# EAGLE design KNXTransceiverBoard_V1.2 (EAGLE 6.1)

## Sheet 1 of 3
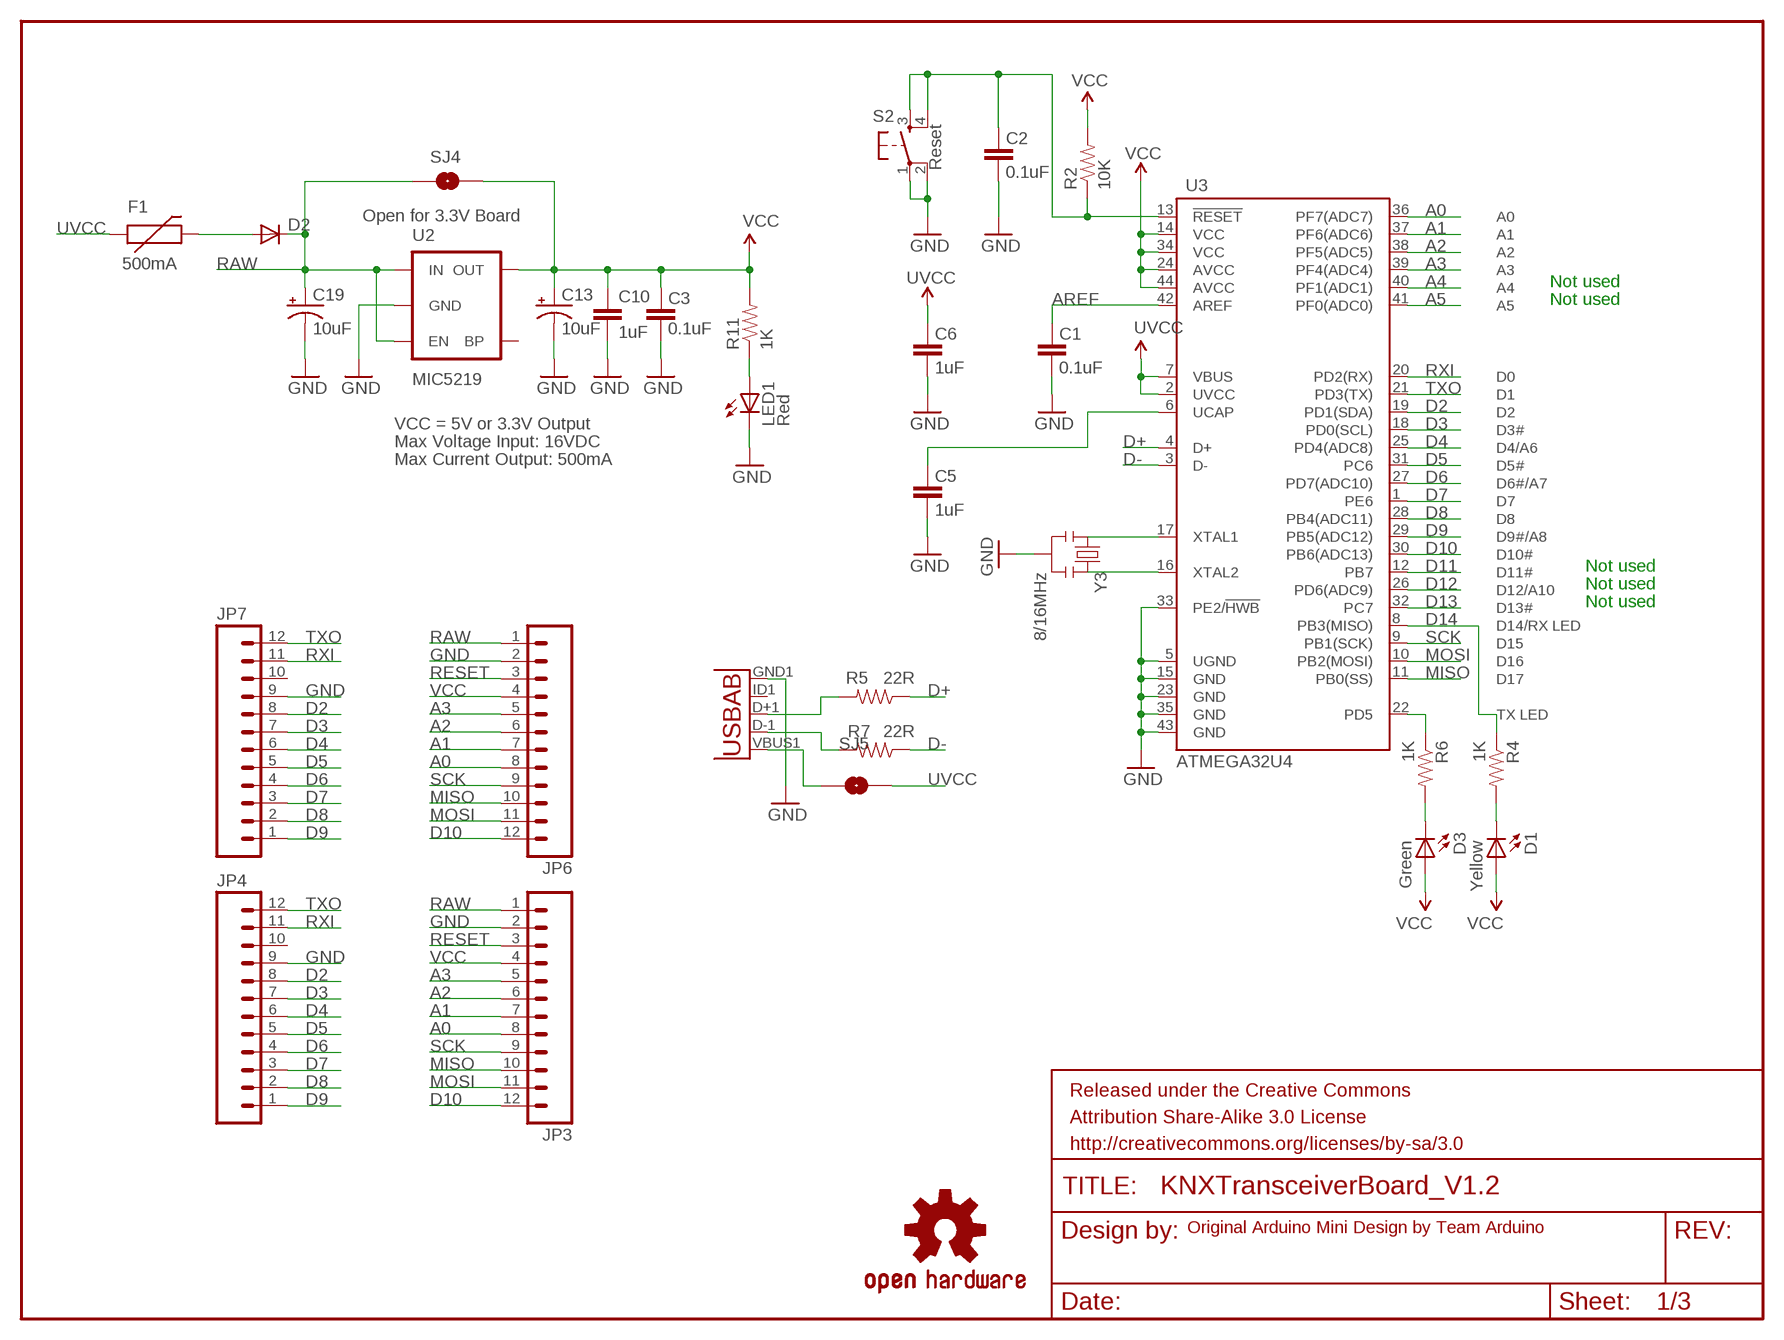
[diagram p0: schematic, sheet 1]

### Parts
C1  0.1uF  CAP0603-CAP  [0603-CAP]
C2  0.1uF  CAP0603-CAP  [0603-CAP]
C3  0.1uF  CAP0603-CAP  [0603-CAP]
C5  1uF  CAP0603-CAP  [0603-CAP]
C6  1uF  CAP0603-CAP  [0603-CAP]
C10  1uF  CAP0603-CAP  [0603-CAP]
C13  10uF  CAP_POL1206  [EIA3216]
C19  10uF  CAP_POL1206  [EIA3216]
D1  Yellow  LED0603  [LED-0603]
D2  DIODESOD  [SOD-323]
D3  Green  LED0603  [LED-0603]
F1  500mA  PTCSMD  [PTC-1206]
FRAME1  FRAME-LETTER  [CREATIVE_COMMONS]
JP3  M12PTH  [1X12]
JP4  M12PTH  [1X12]
JP6  M12PTH  [1X12]
JP7  M12PTH  [1X12]
LED1  Red  LED0603  [LED-0603]
R2  10K  RESISTOR0603-RES  [0603-RES]
R4  1K  RESISTOR0603-RES  [0603-RES]
R5  22R  RESISTOR0603-RES  [0603-RES]
R6  1K  RESISTOR0603-RES  [0603-RES]
R7  22R  RESISTOR0603-RES  [0603-RES]
R11  1K  RESISTOR0603-RES  [0603-RES]
S2  Reset  TAC_SWITCHSMD  [TACTILE_SWITCH_SMD]
SJ4  SOLDERJUMPERNC  [SJ_2S]
SJ5  SOLDERJUMPERNC  [SJ_2S]
U2  MIC5219  V_REG_LDOSMD  [SOT23-5]
U3  ATMEGA32U4  ATMEGA32U4OUTFAKES  [QFN-44-NOPAD_1:1-OUTFAKES]
U$3  OSHW-LOGOS  [OSHW-LOGO-S]
X1  USB-ABIN&OUT  [USB-AB-MICRO-SMD-V03-IN&OUT]
Y3  8/16MHz  RESONATORSMD  [RESONATOR-SMD]

### Nets
A0: JP3.8 JP6.8 U3.36(PF7(ADC7))
A1: JP3.7 JP6.7 U3.37(PF6(ADC6))
A2: JP3.6 JP6.6 U3.38(PF5(ADC5))
A3: JP3.5 JP6.5 U3.39(PF4(ADC4))
A4: U3.40(PF1(ADC1))
A5: U3.41(PF0(ADC0))
AREF: C1.2 U3.42(AREF)
D2: JP4.8 JP7.8 U3.19(PD1(SDA)) ; also sheet 2
D3: JP4.7 JP7.7 U3.18(PD0(SCL)) ; also sheet 2
D4: JP4.6 JP7.6 U3.25(PD4(ADC8))
D5: JP4.5 JP7.5 U3.31(PC6)
D6: JP4.4 JP7.4 U3.27(PD7(ADC10))
D7: JP4.3 JP7.3 U3.1(PE6) ; also sheet 2
D8: JP4.2 JP7.2 U3.28(PB4(ADC11)) ; also sheet 2
D9: JP4.1 JP7.1 U3.29(PB5(ADC12))
D10: JP3.12 JP6.12 U3.30(PB6(ADC13))
D11: U3.12(PB7)
D12: U3.26(PD6(ADC9))
D13: U3.32(PC7)
D14: R4.1 U3.8(PB3(MISO))
D+: R5.1 U3.4(D+)
D-: R7.1 U3.3(D-)
GND [vcc]: C1.1 C2.1 C3.1 C5.1 C6.1 C10.2 C13.C(-) C19.C(-) JP3.2 JP4.9 JP6.2 JP7.9 LED1.C S2.1 S2.2 U2.2(GND) U3.5(UGND) U3.15(GND) U3.23(GND) U3.33(PE2/!HWB) U3.35(GND) U3.43(GND) X1.GND1(GND) Y3.2 ; also sheet 2,3
MISO: JP3.10 JP6.10 U3.11(PB0(SS))
MOSI: JP3.11 JP6.11 U3.10(PB2(MOSI))
N$1: U3.16(XTAL2) Y3.3
N$2: U3.17(XTAL1) Y3.1
N$4: C5.2 U3.6(UCAP)
N$5: D1.C R4.2
N$6: R7.2 X1.D-1(D-)
N$7: D3.C R6.2
N$8: R5.2 X1.D+1(D+)
N$9: D2.2(A) F1.2
N$38: LED1.A R11.1
RAW [vcc]: C19.A(+) D2.1(C) JP3.1 JP6.1 SJ4.1 U2.1(IN) U2.3(EN) ; also sheet 3
RESET: C2.2 JP3.3 JP6.3 R2.1 S2.3 S2.4 U3.13(!RESET)
RXI: JP4.11 JP7.11 U3.20(PD2(RX)) ; also sheet 2
SCK: JP3.9 JP6.9 U3.9(PB1(SCK))
TXLED: R6.1 U3.22(PD5)
TXO: JP4.12 JP7.12 U3.21(PD3(TX)) ; also sheet 2
UVCC: C6.2 F1.1 SJ5.2 U3.2(UVCC) U3.7(VBUS)
VBUS1: SJ5.1 X1.VBUS1(VBUS)
VCC: C3.2 C10.1 C13.A(+) D1.A D3.A JP3.4 JP6.4 R2.2 R11.2 SJ4.2 U2.5(OUT) U3.14(VCC) U3.24(AVCC) U3.34(VCC) U3.44(AVCC) ; also sheet 2,3
Unconnected: JP4.10 JP7.10 U2.4(BP) X1.ID1(USBID)

### Notes on the sheet
- Open for 3.3V Board
- Not used
- Not used
- VCC = 5V or 3.3V Output
- Max Voltage Input: 16VDC
- Max Current Output: 500mA
- Not used
- Not used
- Not used
- Original Arduino Mini Design by Team Arduino

## Sheet 2 of 3
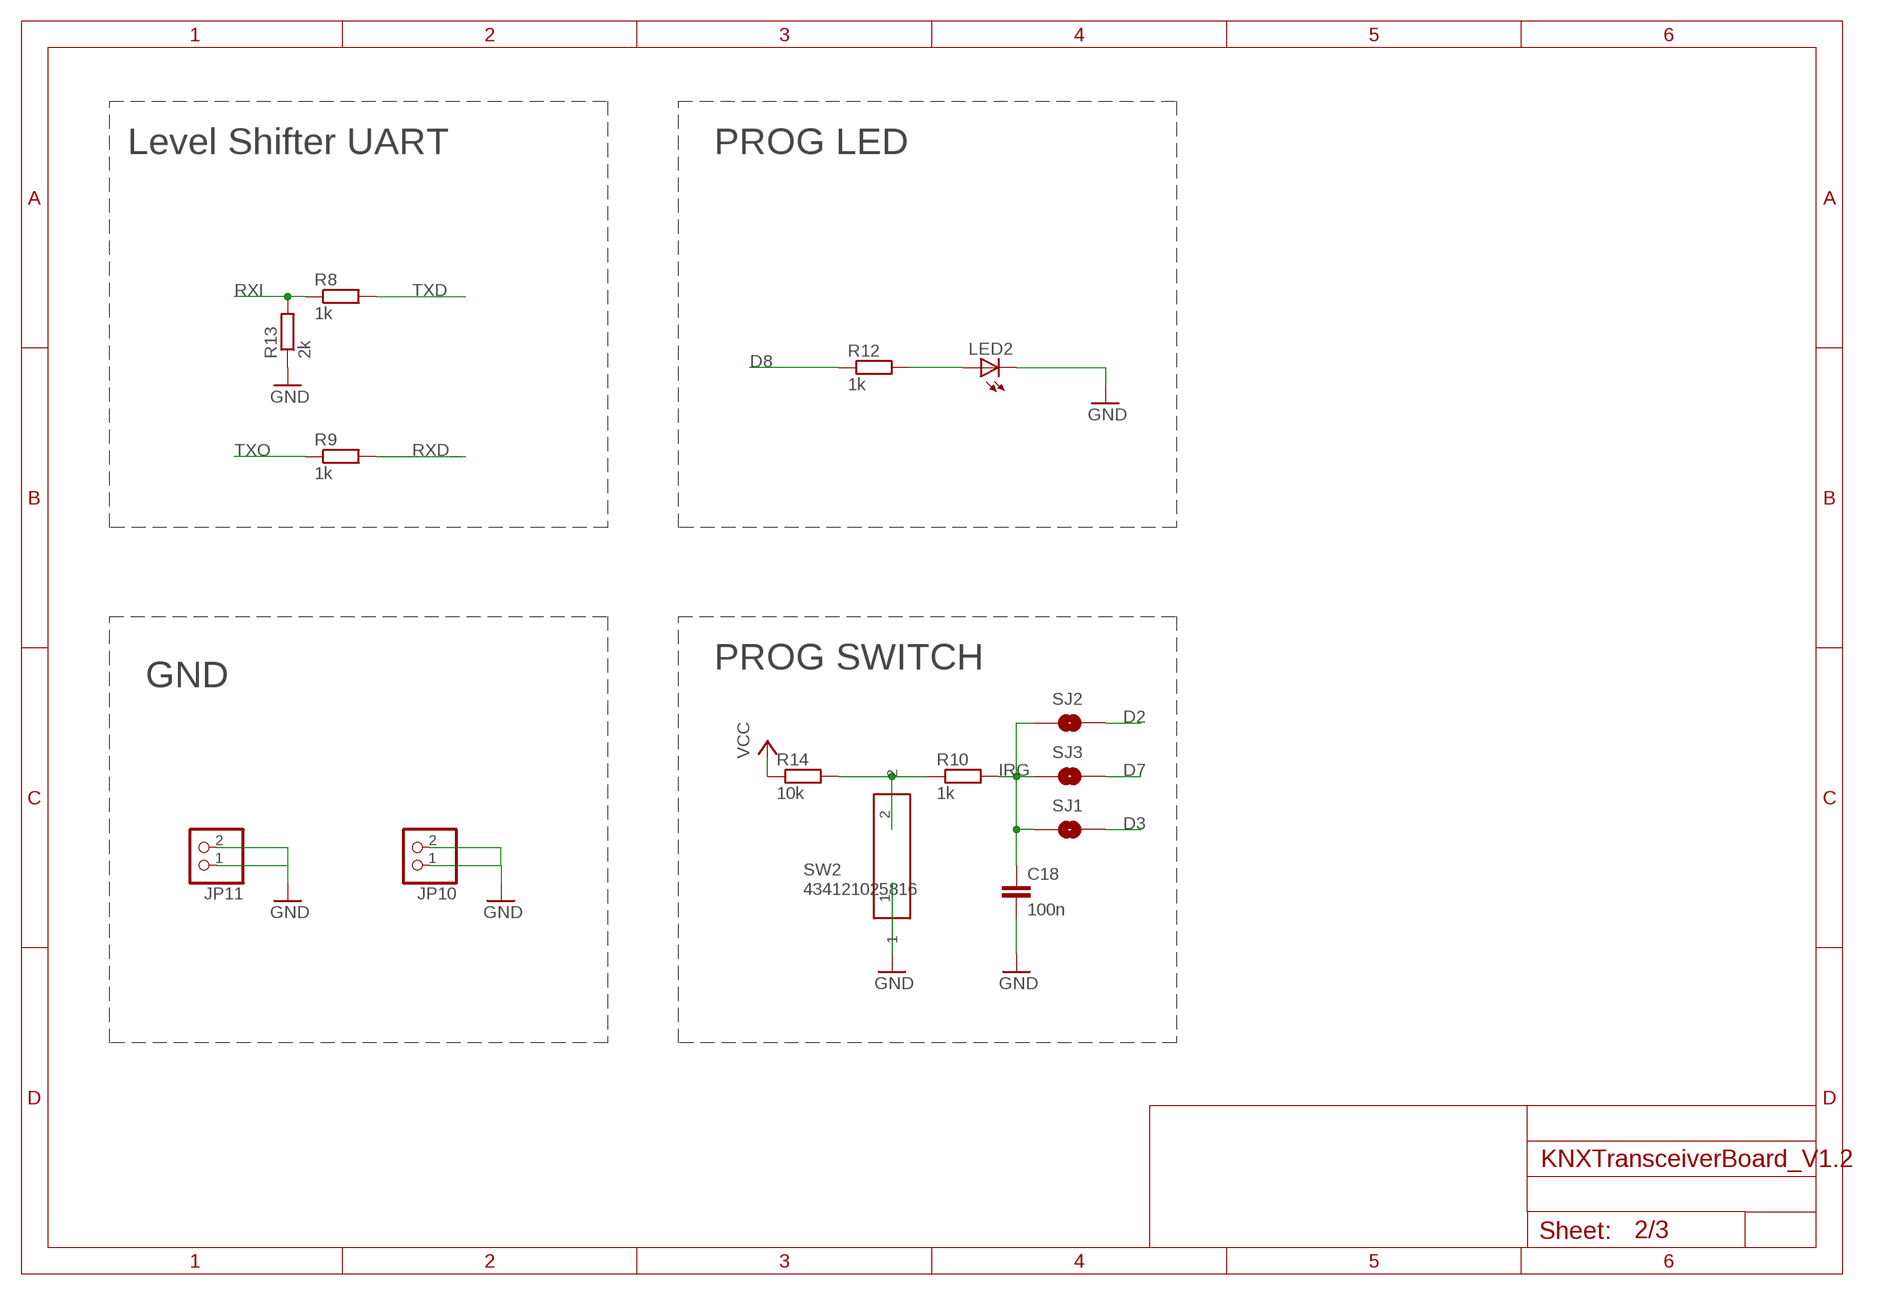
[diagram p1: schematic, sheet 2]

### Parts
C18  100n  C-EUC0603  [C0603]
JP10  PINHD-1X2  [1X02]
JP11  PINHD-1X2  [1X02]
LED2  LEDCHIP-LED0805  [CHIP-LED0805]
R8  1k  R-EU_R0603  [R0603]
R9  1k  R-EU_R0805  [R0805]
R10  1k  R-EU_R0603  [R0603]
R12  1k  R-EU_R0603  [R0603]
R13  2k  R-EU_R0805  [R0805]
R14  10k  R-EU_R0603  [R0603]
SJ1  SOLDERJUMPERNC  [SJ_2S]
SJ2  SOLDERJUMPERNC  [SJ_2S]
SJ3  SOLDERJUMPERNC  [SJ_2S]
SW2  434121025816  [434121025816]

### Nets
D2: SJ2.2 ; also sheet 1
D3: SJ1.2 ; also sheet 1
D7: SJ3.2 ; also sheet 1
D8: R12.1 ; also sheet 1
GND [vcc]: C18.2 JP10.1 JP10.2 JP11.1 JP11.2 LED2.C R13.1 SW2.1 ; also sheet 1,3
IRG: C18.1 R10.2 SJ1.1 SJ2.1 SJ3.1
N$212: LED2.A R12.2
N$237: R10.1 R14.2 SW2.2
RXD: R9.2 ; also sheet 3
RXI: R8.1 R13.2 ; also sheet 1
TXD: R8.2 ; also sheet 3
TXO: R9.1 ; also sheet 1
VCC: R14.1 ; also sheet 1,3

### Notes on the sheet
- Level Shifter UART | PROG LED
- PROG SWITCH
- GND

## Sheet 3 of 3
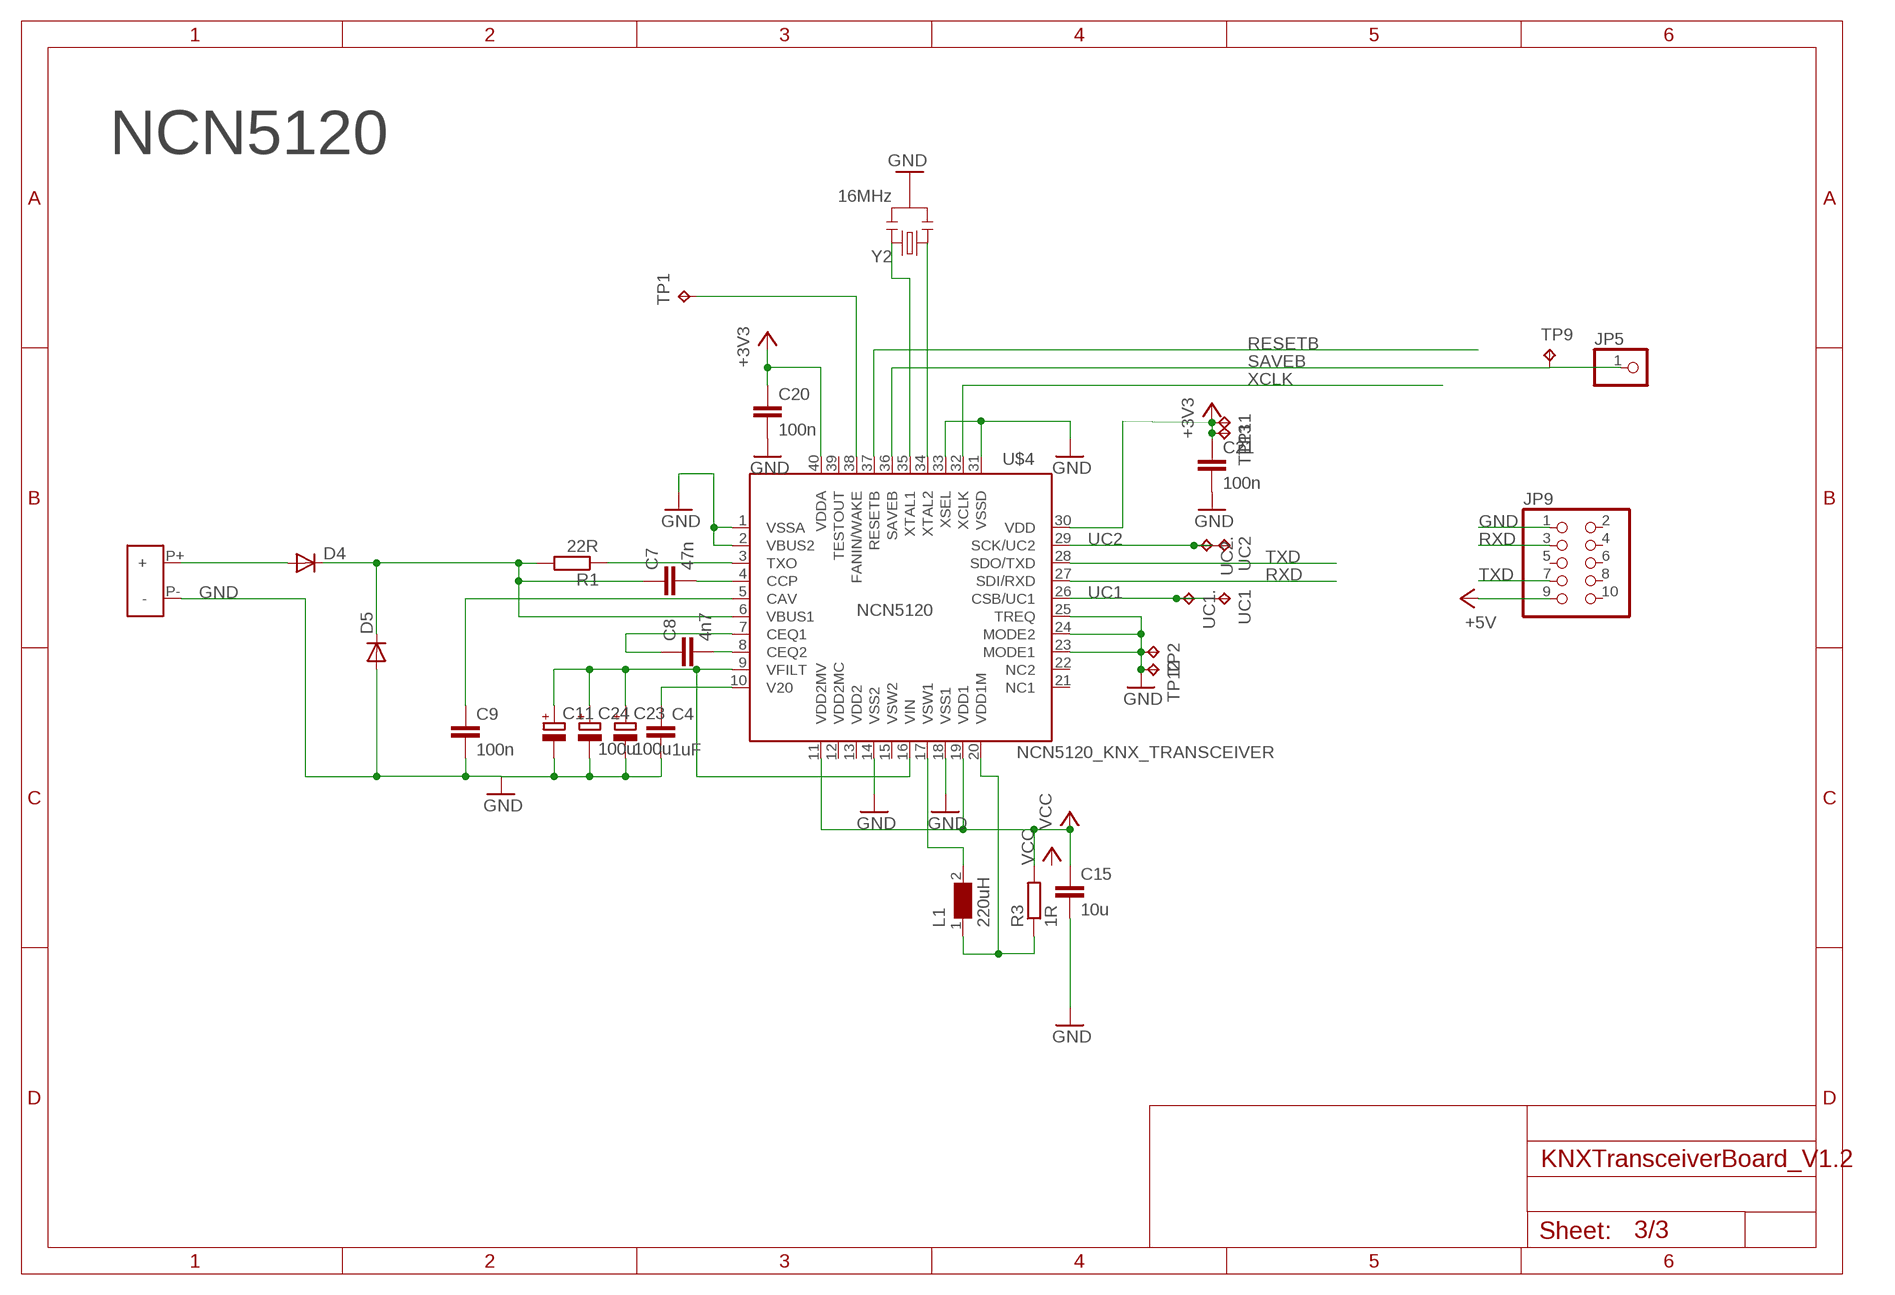
[diagram p2: schematic, sheet 3]

### Parts
C4  1uF  C-EUC0603  [C0603]
C7  47n  C-EUC0603  [C0603]
C8  4n7  C-EUC0603  [C0603]
C9  100n  C-EUC0603  [C0603]
C11  CPOL-EUE  [PANASONIC_E]
C15  10u  C-EUC0805  [C0805]
C20  100n  C-EUC0603  [C0603]
C21  100n  C-EUC0603  [C0603]
C23  100u  CPOL-EUSMCD  [SMC_D]
C24  100u  CPOL-EUSMCD  [SMC_D]
D4  DIODESMA-ALT  [SMA-DIODE_ALT]
D5  DIODESMA-ALT  [SMA-DIODE_ALT]
JP5  PINHD-1X1  [1X01]
JP9  PINHD-2X5  [2X05]
L1  220uH  WE-PD2_7850  [WE-PD2_7850]
R1  22R  R-EU_R2512  [R2512]
R3  1R  R-EU_R0603  [R0603]
TP1  TPTP10SQ  [TP10SQ]
TP2  TPTP09SQ  [TP09SQ]
TP9  TPTP10SQ  [TP10SQ]
TP11  TPTP09SQ  [TP09SQ]
TP12  TPTP09SQ  [TP09SQ]
TP13  TPTP09SQ  [TP09SQ]
U$2  KNX_KLEMME  [KNX_KLEMME]
U$4  NCN5120_KNX_TRANSCEIVER  [QFN40]
UC1  TPTP09SQ  [TP09SQ]
UC1.  TPTP09SQ  [TP09SQ]
UC2  TPTP09SQ  [TP09SQ]
UC2.  TPTP09SQ  [TP09SQ]
Y2  16MHz  RESONATORSMD  [RESONATOR-SMD]

### Nets
GND [vcc]: C4.2 C9.2 C11.- C15.2 C20.2 C21.2 C23.- C24.- D5.A JP9.1 TP2.TP TP12.TP U$2.P-(-) U$4.1(VSSA) U$4.2(VBUS2) U$4.14(VSS2) U$4.18(VSS1) U$4.23(MODE1) U$4.24(MODE2) U$4.25(TREQ) U$4.31(VSSD) U$4.33(XSEL) Y2.2 ; also sheet 1,2
N$10: C7.1 D4.C D5.C R1.2 U$4.6(VBUS1)
N$11: C8.1 U$4.7(CEQ1)
N$12: C11.+ C23.+ C24.+ U$4.9(VFILT) U$4.16(VIN)
N$13: C4.1 U$4.10(V20)
N$15: C7.2 U$4.4(CCP)
N$140: C9.1 U$4.5(CAV)
N$160: C8.2 U$4.8(CEQ2)
N$174: TP1.TP U$4.38(FANIN/WAKE)
N$203: D4.A U$2.P+(+)
N$222: L1.2 U$4.17(VSW1)
N$242: L1.1 R3.1 U$4.20(VDD1M)
N$999: R1.1 U$4.3(TXO)
RAW [vcc]: JP9.9 ; supply symbol labelled +5V ; also sheet 1
RESETB: U$4.37(RESETB)
RXD: JP9.3 U$4.27(SDI/RXD) ; also sheet 2
SAVEB: JP5.1 TP9.TP U$4.36(SAVEB)
TXAL1: U$4.35(XTAL1) Y2.3
TXAL2: U$4.34(XTAL2) Y2.1
TXD: JP9.7 U$4.28(SDO/TXD) ; also sheet 2
UC1: U$4.26(CSB/UC1) UC1..TP UC1.TP
UC2: U$4.29(SCK/UC2) UC2..TP UC2.TP
VCC: C15.1 C20.1 C21.1 R3.2 TP11.TP TP13.TP U$4.11(VDD2MV) U$4.19(VDD1) U$4.30(VDD) U$4.40(VDDA) ; supply symbol labelled +3V3 ; also sheet 1,2
XCLK: U$4.32(XCLK)
Unconnected: JP9.2 JP9.4 JP9.5 JP9.6 JP9.8 JP9.10 U$4.12(VDD2MC) U$4.13(VDD2) U$4.15(VSW2) U$4.21(NC1) U$4.22(NC2) U$4.39(TESTOUT)

### Notes on the sheet
- NCN5120

## Library data of the parts
C1-C3 C5 C6 C10 = SparkFun:CAP: Capacitor Standard 0603 ceramic capacitor, and 0.1" leaded capacitor.
C4 C7-C9 C15 C18 C20 C21 = rcl:C-EU: CAPACITOR, European symbol
C11 C23 C24 = rcl:CPOL-EU: POLARIZED CAPACITOR, European symbol
C13 C19 = SparkFun:CAP_POL: Capacitor Polarized These are standard SMD and PTH capacitors. Normally 10uF, 47uF, and 100uF in electrolytic and tantalum varieties. Always verify the external diameter of the through hole cap, it varies with capacity, voltage, and manufacturer. The EIA devices should be standard.
D1 D3 LED1 = SparkFun:LED: LEDs Standard schematic elements and footprints for 5mm, 3mm, 1206, and 0603 sized LEDs. 5mm - Spark Fun Electronics SKU : COM-00529 (and others)
D2 D4 D5 = SparkFun:DIODE: Diode These are standard reverse protection diodes and small signal diodes. SMA package can handle up to about 1A. SOD-323 can handle about 200mA. What the SOD-323 package when ordering, there are some mfgs out there that are 5-pin packages.
F1 = SparkFun:PTC: Resettable Fuse PTC Resettable Fuse. Spark Fun Electronics SKU : COM-08357
FRAME1 = SparkFun-Aesthetics:FRAME-LETTER: Schematic Frame Standard 8.5x11 US Letter frame
JP3 JP4 JP6 JP7 = SparkFun:M12: Header 12 Standard 12-pin 0.1" header. Use with straight break away headers (SKU : PRT-00116), right angle break away headers (PRT-00553), swiss pins (PRT-00743), machine pins (PRT-00117), and female headers (PRT-00115).
JP5 = pinhead:PINHD-1X1: PIN HEADER
JP9 = pinhead:PINHD-2X5: PIN HEADER
JP10 JP11 = pinhead:PINHD-1X2: PIN HEADER
L1 = Wuerth_PowerMagnetics:WE-PD2: SMD-Power Inductors WE-PD2 - Industry standard size - Current capability up to 14 A -- Switching regulators with low operating voltages (computer, laptop, mobile phones, pagers) -- Integrated DC/DC-converter -- Is recommended for the application with switching regulators from National Semiconductor, Linear Technology, Texas Instruments and Fairchild Semiconductor -- Perfectly suitable for switching regulators with extremely high efficiency
LED2 = led:LED: LED OSRAM: - CHIPLED LG R971, LG N971, LY N971, LG Q971, LY Q971, LO R971, LY R971 LH N974, LH R974 LS Q976, LO Q976, LY Q976 LO Q996 - Hyper CHIPLED LW Q18S LB Q993, LB Q99A, LB R99A - SideLED LS A670, LO A670, LY A670, LG A670, LP A670 LB A673, LV A673, LT A673, LW A673 LH A674 LY A675 LS A676, LA A676, LO A676, LY A676, LW A676 LS A679, LY A679, LG A679 - Hyper Micro SIDELED® LS Y876, LA Y876, LO Y876, LY Y876 LT Y87S - SmartLED LW L88C, LW L88S LB L89C, LB L89S, LG L890 LS L89K, LO L89K, LY L89K LS L896, LA L896, LO L896, LY L896 - TOPLED LS T670, LO T670, LY T670, LG T670, LP T670 LSG T670, LSP T670, LSY T670, LOP T670, LYG T670 LG T671, LOG T671, LSG T671 LB T673, LV T673, LT T673, LW T673 LH T674 LS T676, LA T676, LO T676, LY T676, LB T676, LH T676, LSB T676, LW T676 LB T67C, LV T67C, LT T67C, LS T67K, LO T67K, LY T67K, LW E67C LS E67B, LA E67B, LO E67B, LY E67B, LB E67C, LV E67C, LT E67C LW T67C LS T679, LY T679, LG T679 LS T770, LO T770, LY T770, LG T770, LP T770 LB T773, LV T773, LT T773, LW T773 LH T774 LS E675, LA E675, LY E675, LS T675 LS T776, LA T776, LO T776, LY T776, LB T776 LHGB T686 LT T68C, LB T68C - Hyper Mini TOPLED® LB M676 - Mini TOPLED Santana® LG M470 LS M47K, LO M47K, LY M47K Source: http://www.osram.convergy.de LUXEON: - LUMILED® LXK2-PW12-R00, LXK2-PW12-S00, LXK2-PW14-U00, LXK2-PW14-V00 LXK2-PM12-R00, LXK2-PM12-S00, LXK2-PM14-U00 LXK2-PE12-Q00, LXK2-PE12-R00, LXK2-PE12-S00, LXK2-PE14-T00, LXK2-PE14-U00 LXK2-PB12-K00, LXK2-PB12-L00, LXK2-PB12-M00, LXK2-PB14-N00, LXK2-PB14-P00, LXK2-PB14-Q00 LXK2-PR12-L00, LXK2-PR12-M00, LXK2-PR14-Q00, LXK2-PR14-R00 LXK2-PD12-Q00, LXK2-PD12-R00, LXK2-PD12-S00 LXK2-PH12-R00, LXK2-PH12-S00 LXK2-PL12-P00, LXK2-PL12-Q00, LXK2-PL12-R00 Source: www.luxeon.com KINGBRIGHT: KA-3528ASYC Source: www.kingbright.com
R1 R3 R8-R10 R12-R14 = rcl:R-EU_: RESISTOR, European symbol
R2 R4-R7 R11 = SparkFun:RESISTOR: Resistor Basic schematic elements and footprints for 0603, 1206, and PTH resistors.
S2 = SparkFun:TAC_SWITCH: Momentary Switch Button commonly used for reset or general input. Spark Fun Electronics SKU : COM-00097
SJ1-SJ5 = SparkFun:SOLDERJUMPER: Solder Jumper Standard SMD solder jumper. Used to automate production. Two varients : Normally Open and Normally Closed are the same, but have different paste layers. NC will have a large amount of paste and should jumper during reflow.
SW2 = Wuerth_Kurzhubtaster:434121025816: WS-TRS-6x3.8 mm SMD Tact Switch, 2 pins
TP1 TP2 TP9 TP11-TP13 UC1 UC1. UC2 UC2. = testpad:TP: Test pad
U2 = SparkFun:V_REG_LDO: Voltage Regulator LDO Standard 150mA LDO voltage regulator in SOT-23 layout. Micrel part MIC5205. BP (by-pass) pin is used to lower output noise with 470pF cap.
U3 = Testing:ATMEGA32U4: Atmel 44-pin 8-bit Microcontroller with 32KBytes of ISP Flash and USB Controller
U$2 = Matthias_1:KNX_KLEMME
U$3 = SparkFun:OSHW-LOGO: Open Source Hardware Logo This logo indicates the piece of hardware it is found on incorporates a OSHW license and/or adheres to the definition of open source hardware found here: http://freedomdefined.org/OSHW
U$4 = Matthias_1:NCN5120_KNX_TRANSCEIVER
X1 = Testing:USB-AB: This is a USB AB connector that is compatible with USB OTG. i.e. this connector can serve as a host or device
Y2 Y3 = SparkFun:RESONATOR: Resonator Small SMD resonator. This is the itty bitty 10/20MHz resonators with built in caps. CSTCE10M0G55 and CSTCE20M0V53. Footprint has been reviewed closely but hasn't been tested yet.

## Net classes
0 default: width 0.203 mm
1 vcc: width 0.254 mm

## Board
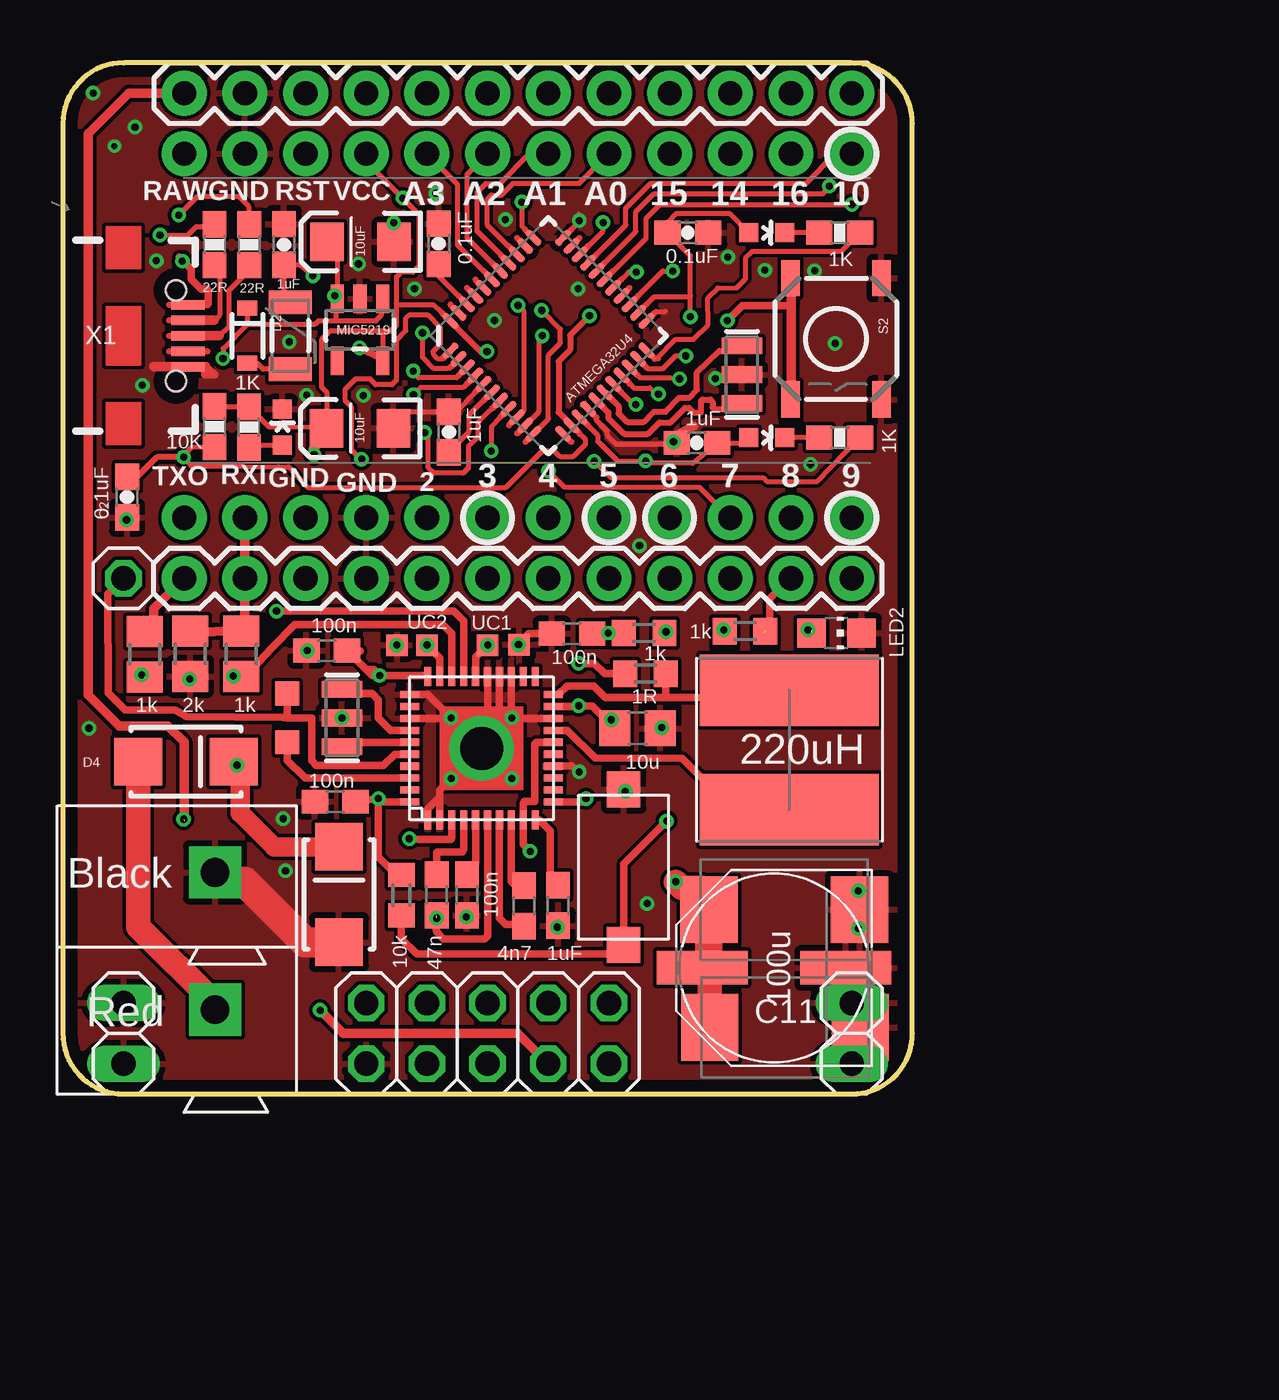
[diagram p3: board, top side]
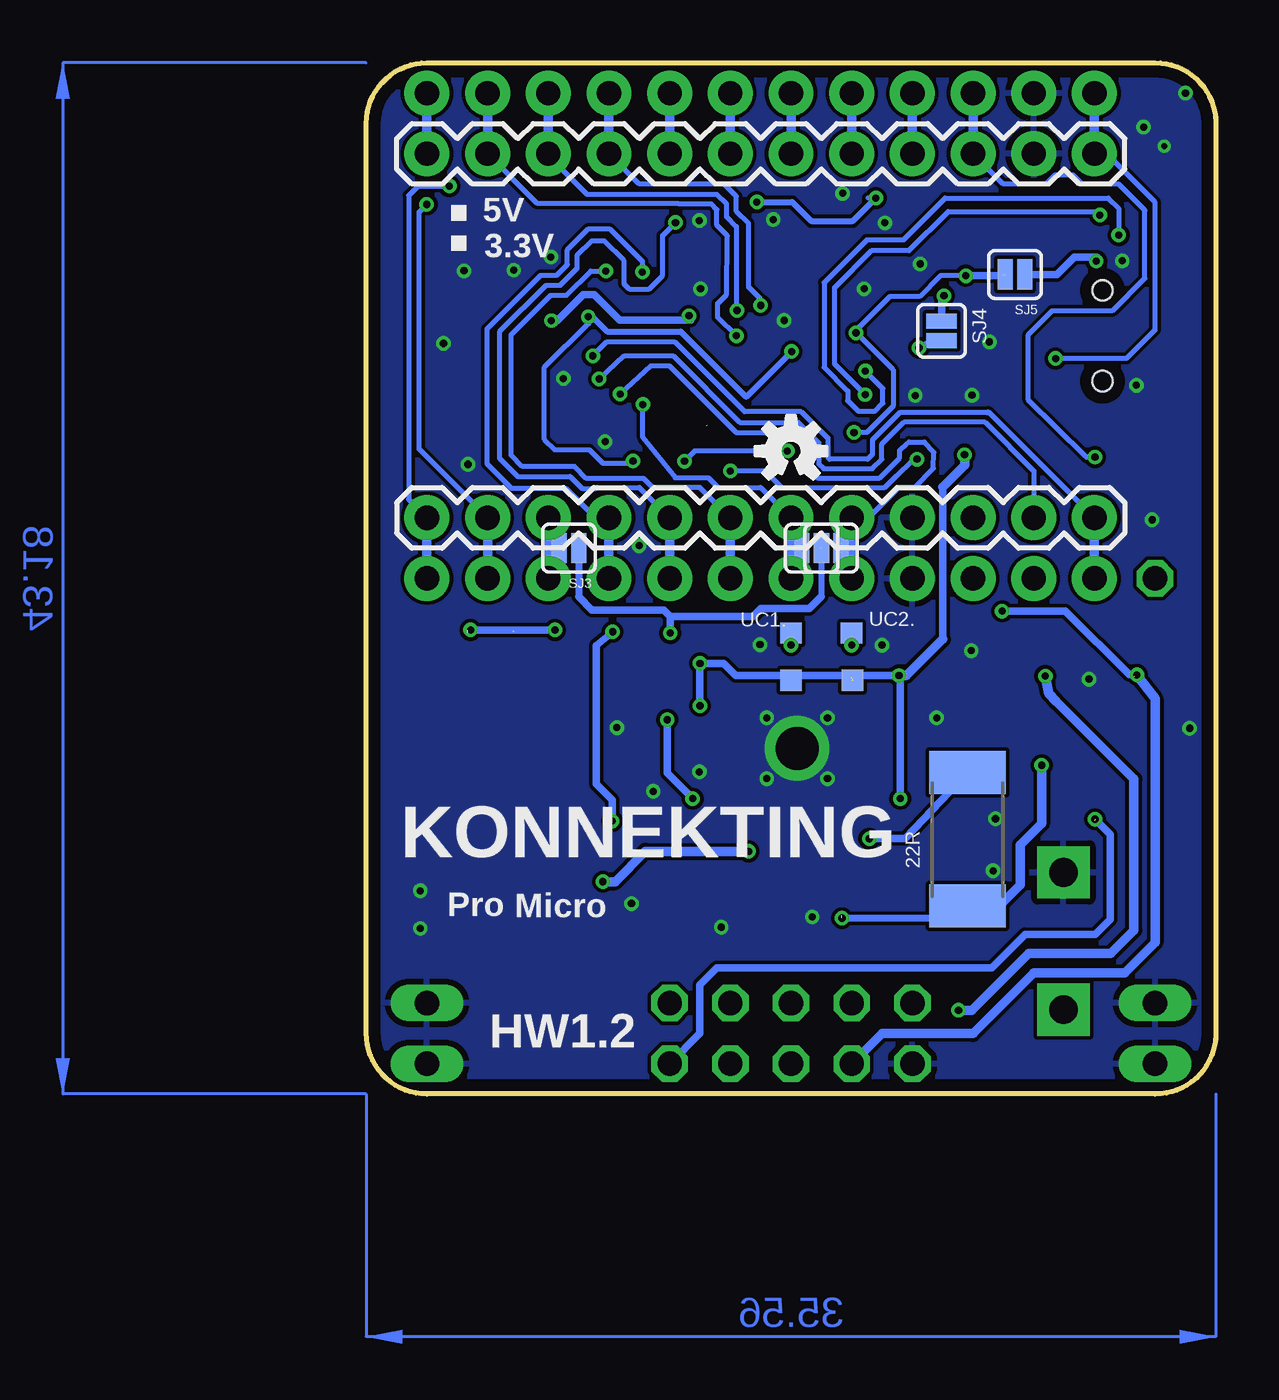
[diagram p4: board, bottom side, seen from below]

Size 35.56 x 43.18 mm. Coordinates in mm from the lower left corner, seen from the top.
Outline: 0,2.54 arc90 2.54,0 33.02,0 arc90 35.56,2.54 35.56,40.64 arc90 33.02,43.18 2.54,43.18 arc90 0,40.64 0,2.54
Copper layers (1*16): Top 0.035mm / dielectric 1.6mm / Bottom 0.035mm
Design rules: minimum track width 6mil, minimum drill 12mil, track to track 6mil, track to pad 6mil, pad to pad 6mil, via to via 8mil, smd to smd 0mil, copper to edge 20mil, drill to drill 10mil, minimum pad ring 6mil, minimum via ring 6mil, stop-mask expansion 0mil, vias tented up to drill 100mil, thermal gap 10mil
tRestrict: area -21.3,-1.8 to -21.1,-1.7; area -17.4,2.2 to -17.3,2.2; area -25,-1.2 to -17.9,6.1

### Footprints (pad centres in the part's own frame; a part is rotated, then mirrored left to right if it is on the bottom)
0603-CAP = smd 1.1 x 1: 1 -0.85,0; 2 0.85,0
C0603 = smd 1.1 x 1: 1 -0.85,0; 2 0.85,0
PANASONIC_E = smd 3.8 x 1.4: + 3,0; - -3,0
EIA3216 = smd 1.4 x 1.6: A 1.4,0; C -1.4,0
C0805 = smd 1.3 x 1.5: 1 -0.95,0; 2 0.95,0
SMC_D = smd 2.4 x 2.8: + -3.15,0; - 3.15,0
LED-0603 = smd 0.8 x 0.8: A 0,-0.75; C 0,0.75
SOD-323 = smd 0.63 x 0.83: 1 -1.15,0; 2 1.15,0
SMA-DIODE_ALT = smd 2 x 2: A -2,0; C 2,0
PTC-1206 = smd 1 x 1.8: 1 -1.4,0; 2 1.4,0
1X12 = drill 1.016 pad 1.88: 1 0,0; 2 2.54,0; 3 5.08,0; 4 7.62,0; 5 10.16,0; 6 12.7,0; 7 15.24,0; 8 17.78,0; 9 20.32,0; 10 22.86,0; 11 25.4,0; 12 27.94,0
1X01 = drill 1.016 octagon: 1 0,0
2X05 = drill 1.016 octagon: 1 -5.08,-1.27; 2 -5.08,1.27; 3 -2.54,-1.27; 4 -2.54,1.27; 5 0,-1.27; 6 0,1.27; 7 2.54,-1.27; 8 2.54,1.27; 9 5.08,-1.27; 10 5.08,1.27
1X02 = drill 1.016 long: 1 -1.27,0; 2 1.27,0
WE-PD2_7850 = smd 3 x 7.5: 1 -2.5,0; 2 2.5,0
CHIP-LED0805 = smd 1.2 x 1.2: A 0,-1.05; C 0,1.05
R2512 = smd 1.8 x 3.2: 1 -2.8,0; 2 2.8,0
0603-RES = smd 1.1 x 1: 1 -0.85,0; 2 0.85,0
R0603 = smd 1 x 1.1: 1 -0.85,0; 2 0.85,0
R0805 = smd 1.3 x 1.5: 1 -0.95,0; 2 0.95,0
TACTILE_SWITCH_SMD = smd 1.524 x 0.762: 1 -2.54,1.905; 2 2.54,1.905; 3 -2.54,-1.905; 4 2.54,-1.905
SJ_2S = smd 0.635 x 1.27: 1 -0.412,0; 2 0.412,0
434121025816 = smd 1.5 x 1.4: 1 -3.25,0; 2 3.25,0
TP10SQ = smd 1 x 1: TP 0,0
TP09SQ = smd 0.9 x 0.9: TP 0,0
SOT23-5 = smd 0.55 x 1.2: 1 -0.95,-1.3; 2 0,-1.3; 3 0.95,-1.3; 4 0.95,1.3; 5 -0.95,1.3
QFN-44-NOPAD_1:1-OUTFAKES = smd 0.8 x 0.3: 1 -3.337,2.465; 2 -3.337,1.972; 3 -3.337,1.479; 4 -3.337,0.986; 5 -3.337,0.493; 6 -3.337,0; 7 -3.337,-0.493; 8 -3.337,-0.986; 9 -3.337,-1.479; 10 -3.337,-1.972; 11 -3.337,-2.465; 23 3.337,-2.465; 24 3.337,-1.972; 25 3.337,-1.479; 26 3.337,-0.986; 27 3.337,-0.493; 28 3.337,0; 29 3.337,0.493; 30 3.337,0.986; 31 3.337,1.479; 32 3.337,1.972; 33 3.337,2.465 | smd 0.3 x 0.8: 12 -2.465,-3.337; 13 -1.972,-3.337; 14 -1.479,-3.337; 15 -0.986,-3.337; 16 -0.493,-3.337; 17 0,-3.337; 18 0.493,-3.337; 19 0.986,-3.337; 20 1.479,-3.337; 21 1.972,-3.337; 22 2.465,-3.337; 34 2.465,3.337; 35 1.972,3.337; 36 1.479,3.337; 37 0.986,3.337; 38 0.493,3.337; 39 0,3.337; 40 -0.493,3.337; 41 -0.986,3.337; 42 -1.479,3.337; 43 -1.972,3.337; 44 -2.465,3.337
KNX_KLEMME = drill 1.2 pad 2.184 square: P+ 0,-3.2; P- 0,2.55
QFN40 = smd 0.3 x 0.8: 1 -2.25,-3; 2 -1.75,-3; 3 -1.25,-3; 4 -0.75,-3; 5 -0.25,-3; 6 0.25,-3; 7 0.75,-3; 8 1.25,-3; 9 1.75,-3; 10 2.25,-3; 21 2.25,3; 22 1.75,3; 23 1.25,3; 24 0.75,3; 25 0.25,3; 26 -0.25,3; 27 -0.75,3; 28 -1.25,3; 29 -1.75,3; 30 -2.25,3 | smd 0.8 x 0.3: 11 3,-2.25; 12 3,-1.75; 13 3,-1.25; 14 3,-0.75; 15 3,-0.25; 16 3,0.25; 17 3,0.75; 18 3,1.25; 19 3,1.75; 20 3,2.25; 31 -3,2.25; 32 -3,1.75; 33 -3,1.25; 34 -3,0.75; 35 -3,0.25; 36 -3,-0.25; 37 -3,-0.75; 38 -3,-1.25; 39 -3,-1.75; 40 -3,-2.25
USB-AB-MICRO-SMD-V03-IN&OUT = smd 1.4 x 0.4: D+1 2.7,0; D-1 2.7,0.65; GND1 2.7,-1.3; ID1 2.7,-0.65; VBUS1 2.7,1.3 | hole 0.85: 2.2,1.9; 2.2,-1.9
RESONATOR-SMD = smd 0.7 x 1.7: 1 -1.2,0; 2 0,0; 3 1.2,0

### Placement (x,y rotation side)
C1  15.73,35.6 270 top
C2  2.69,24.99 90 top
C3  26.16,36.07 180 top
C4  20.73,7.9 270 top
C5  16.15,27.71 270 top
C6  9.26,35.57 270 top
C7  15.65,8.33 90 top
C8  19.3,7.87 90 top
C9  16.92,8.33 270 top
C10  26.54,27.27 180 top
C11  29.77,5.28 180 top
C13  12.44,27.88 180 top
C15  24.05,15.32 0 top
C18  21.31,19.28 180 top
C19  12.46,35.68 180 top
C20  11.4,12.24 180 top
C21  11.05,18.57 180 top
C23  30.2,7.72 0 top
C24  30.23,2.79 0 top
D1  29.46,27.48 270 top
D2  7.72,31.75 270 top
D3  29.46,36.07 270 top
D4  5.16,13.92 0 top
D5  11.56,8.36 90 top
F1  9.53,31.75 270 top
FRAME1  -47.73,-21.59 0 top  (outside the outline)
JP3  5.08,41.91 0 top
JP4  33.02,21.59 180 top
JP5  2.54,21.59 0 top
JP6  5.08,39.37 180 bottom
JP7  33.02,24.13 0 bottom
JP9  17.78,2.54 0 top
JP10  33.02,2.54 90 top
JP11  2.54,2.54 90 top
L1  30.4,14.4 270 top
LED1  9.18,27.93 0 top
LED2  32.39,19.3 270 top
R1  10.39,10.67 270 bottom
R2  6.35,27.94 90 top
R3  24.38,17.6 180 top
R4  32.51,27.48 180 top
R5  7.8,35.56 270 top
R6  32.51,36.07 180 top
R7  6.35,35.56 270 top
R8  1k  [R0805]  7.47,18.44 270 top
R9  3.43,18.41 270 top
R10  24.33,19.3 180 top
R11  7.79,27.93 90 top
R12  28.55,19.38 180 top
R13  5.33,18.44 90 top
R14  14.17,8.33 270 top
S2  32.36,31.62 270 top
SJ1  16.92,22.86 180 bottom
SJ2  16.1,22.86 0 bottom
SJ3  27.08,22.86 180 bottom
SJ4  11.48,31.95 270 bottom
SJ5  8.41,34.32 180 bottom
SW2  23.47,9.5 270 top
TP1  9.4,14.73 0 top
TP2  14,18.8 0 top
TP9  9.4,16.76 0 top
TP11  15.21,17.32 0 bottom
TP12  19.1,18.82 0 top
TP13  17.78,17.32 0 bottom
U2  12.44,32 180 top
U3  20.32,31.75 45 top
U$2  6.38,6.73 0 top
U$3  17.78,26.92 0 bottom
U$4  17.53,14.48 0 top
UC1  17.78,18.8 0 top
UC1.  17.78,19.3 0 bottom
UC2  15.24,18.8 0 top
UC2.  15.24,19.3 0 bottom
X1  2.54,31.75 0 top
Y2  11.68,15.75 270 top
Y3  28.42,30.12 270 top

### Tracks (layer width: path | path; a pad name or v marks a point on that pad's centre or on a via)
A0
  Top 0.203: U3.36 17.77,36.39 17.77,37.47 17.94,37.64 18.35,37.64 18.84,38.13 21.62,38.13 JP6.8
  Bottom 0.406: JP3.8 JP6.8
A1
  Top 0.203: U3.37 17.34,36.12 17.34,37.77 17.7,38.13 18.28,38.13 19.53,39.37 JP6.7
  Bottom 0.406: JP3.7 JP6.7
A2
  Top 0.203: U3.38 16.93,35.84 16.93,38.52 JP6.6
  Bottom 0.406: JP3.6 JP6.6
A3
  Top 0.203: 16.52,35.54 16.52,35.55 | 17.61,34.46 16.52,35.55 | 16.52,35.55 16.52,38.08 JP6.5
  Bottom 0.406: JP3.5 JP6.5
AREF
  Top 0.203: 16.57,33.41 15.73,34.25 C1.2
D2  (via drill 0.3)
  Top 0.203: 23.72,29.74 23.9,29.57 24.57,29.57 v24.93,29.31
  Bottom 0.203: v24.93,29.31 23.66,30.48 22.86,30.48 20.07,27.69 17.6,27.69 17,27.09 17,26.14 16.66,25.79 14.07,25.79 13.23,26.63 13.23,26.96 12.94,27.23 12.83,27.3 12.2,27.3 11.8,26.88 11.82,26.2 12.58,25.41 13.24,25.41 14.53,24.13 JP7.8
  Bottom 0.406: JP4.8 15.24,22.86 | 15.24,22.86 JP7.8 | SJ2.2 15.24,22.86
D3  (via drill 0.3)
  Top 0.203: 23.38,29.39 23.88,28.88 v23.99,28.88
  Bottom 0.203: JP7.7 19.05,25.4 20.83,25.4 21.23,25.81 22.63,25.81 23.99,27.49 v23.99,28.88
  Bottom 0.406: JP4.7 17.78,22.86 | 17.78,22.86 JP7.7 | SJ1.2 17.78,22.86
D4  (via drill 0.3)
  Top 0.203: 24.07,33.41 25.12,34.46 v25.53,34.46
  Bottom 0.203: JP7.6 21.59,25.4 23.57,25.4 23.95,25.78 26.34,25.78 26.84,26.28 29.03,26.28 29.5,26.75 29.5,31.79 27.84,33.44 27.19,33.44 26.17,34.46 v25.53,34.46
  Bottom 0.406: JP4.6 JP7.6
D5  (via drill 0.3)
  Top 0.203: 21.98,35.5 22.61,36.13 v22.61,36.49
  Bottom 0.203: JP7.5 24.13,25.4 25.91,25.4 25.95,25.36 26.53,25.36 27.02,25.85 29.22,25.85 29.99,26.62 29.99,31.91 28.04,33.86 27.43,33.86 27.43,33.87 26.74,34.57 26.74,35.11 26.13,35.72 25.6,35.72 24.77,34.9 24.77,33.91 24.56,33.71 23.72,33.71 23.16,34.27 23.16,35.95 v22.61,36.49
  Bottom 0.406: JP4.5 JP7.5
D6  (via drill 0.3)
  Top 0.203: v24,34.42 23.69,34.42 v24,34.42 | U3.27 23.68,34.42 v24,34.42
  Bottom 0.203: v24,34.42 24,34.87 25.37,36.23 26.26,36.23 27.14,35.35 27.14,34.73 27.6,34.27 28.27,34.27 30.51,32.03 30.51,26.39 29.49,25.37 27.22,25.37 25.98,24.13 JP7.4
  Bottom 0.406: JP4.4 JP7.4
D7  (via drill 0.3)
  Top 0.203: JP7.3 26.67,25.4 21.01,25.4 v20.32,26.09 | v12.51,26.58 12.36,26.68 12.14,26.89 12.29,26.75 12.07,26.98 12.07,28.78 11.83,29.03 11.83,29.52 12.26,29.95 12.85,29.95 13.09,29.7 13.78,29.7 13.96,29.89 13.96,31.58 13.98,31.58 14.36,31.96 14.36,32.5 14.51,32.63 15.27,32.63 15.8,32.1 15.8,31.41 15.5,31.1 15.53,30.95 15.7,30.78 15.91,30.78 U3.1 15.9,30.79
  Bottom 0.203: v12.51,26.58 12.68,26.55 12.67,26.57 13.4,25.86 13.86,25.4 18.16,25.4 18.85,26.09 v20.32,26.09
  Bottom 0.406: JP4.3 27.94,22.86 | 27.94,22.86 JP7.3 | SJ3.2 27.94,22.86
D8  (via drill 0.3)  (1 unrouted)
  Top 0.203: U3.28 24.41,35.84 24.41,36.66 24.98,37.24 31.62,37.24 31.64,37.25 v33.03,37.25
  Top 0.305: JP4.2 30.43,21.59 29.59,20.75 29.59,19.58 29.36,19.36
  Bottom 0.203: JP7.2 33.35,27 33.35,36.93 v33.03,37.25
  Bottom 0.406: JP4.2 JP7.2
D9  (via drill 0.3)
  Top 0.203: 22.68,34.81 23.99,36.12 23.99,36.94 24.74,37.69 31.8,37.69 32.08,37.98 v32.08,38.02
  Bottom 0.203: JP7.1 33.78,24.89 33.78,37.62 33.38,38.02 v32.08,38.02
  Bottom 0.406: JP4.1 JP7.1
D10
  Top 0.203: JP6.12 32.33,39.37 31.09,38.12 24.59,38.12 23.56,37.1 23.56,36.39 U3.30
  Bottom 0.406: JP3.12 JP6.12
D14  (via drill 0.3)
  Top 0.203: R4.1 31.58,25.65 29.46,25.65 29.31,25.81 22.95,25.81 v22.24,26.5 | 18.32,28.36 17.93,27.94 v17.93,26.92
  Bottom 0.203: v17.93,26.92 21.81,26.92 v22.24,26.5
D+  (via drill 0.3)
  Top 0.203: v4.85,36.8 5.64,37.59 7.37,37.59 7.8,37.16 R5.1 | U3.4 16.76,29.58 14.97,29.58 v14.68,29.29
  Bottom 0.203: v4.85,36.8 5,36.96 11.2,36.96 12.85,35.31 14.42,35.31 15.95,33.77 15.97,33.77 15.97,30.58 v14.68,29.29
D-  (via drill 0.3)
  Top 0.203: 6.03,36.41 R7.1 6.26,36.32 5.59,36.32 5.23,35.97 v4.06,35.97 | v14.67,30.27 14.89,30 16.48,30 16.58,30.1
  Bottom 0.203: v4.06,35.97 4.06,37.08 4.5,37.52 11.33,37.52 13.08,35.76 14.62,35.76 16.39,33.98 16.39,30.43 15.4,29.44 15.4,29.04 15.41,29.04 14.95,28.58 14.29,28.58 13.93,28.93 13.93,29.54 v14.67,30.27
GND  (via drill 0.25, 0.3, 1.8)
  Top 0.203: 21.67,36.57 v21.61,36.58 | U3.33 21.59,36.51 21.59,36.83 | C3.1 26.82,36.07 | 22.33,28.34 22.33,28.22 22.79,27.76 22.79,27.57 23.15,27.21 25.1,27.21 25.49,27.34 C10.2 25.64,27.54 | 24.77,32.72 24.82,32.77 25.22,32.77 | 13.84,28.24 C13.C 14.47,28.56 C5.1 16.44,28.56 17.28,29.4
  Top 0.305: U$4.23 18.78,15.77 v18.8,15.75 | U$4.25 17.78,15.75 18.29,15.75 | 18.29,15.75 v18.8,15.75 | U$4.24 18.28,15.76 18.29,15.75 | U$4.33 16.24,15.73 v16.26,15.75 15.28,16.73 U$4.31 | U$4.2 15.78,12.45 | 15.78,12.45 15.78,12.73 v16.26,13.21 | U$4.1 15.28,11.95 15.78,12.45 | U$4.18 18.79,15.73 | 18.79,15.73 18.75,15.77 | 18.79,15.73 v18.79,15.74 v18.8,15.75 | U$4.14 21.3,13.73 v21.61,13.49 | C18.2 19.51,19.28 19.03,18.8 19.03,19.02 19.05,19.05 | 3.81,30.48 3.81,30.45 5.94,30.45 5.97,30.48 | 5.97,30.48 5.99,30.51 5.99,30.4 5.94,30.35 5.94,30.12 6.35,30.12 5.97,30.48
  Top 0.406: X1.GND1 3.81,30.45 | 26.4,27.98 25.64,27.54
  Top 1.27: D5.A 10.15,6.36 7.62,8.89 6.35,8.89
  other vias: 32.33,31.43 15.62,37.72 12.37,34.76 18.52,36.61 14.72,33.72 12.58,29.25 2.16,39.69 9.48,31.49 27.83,35.05 13.85,36.48 3.33,29.68 31.3,26.37 27.31,29.96 10.21,29.26 29.39,34.5 17.53,14.48 18.8,13.21 11.68,15.75 25.07,15.34 16.89,7.42 10.24,18.57 20.7,6.98 33.3,8.51 33.3,6.93 19.08,18.82 13.97,18.8 5.31,17.37 23.55,12.67 1.27,41.91 3.02,40.49 18.07,32.4 21.57,33.72 25.56,27.32 24.14,22.96 2.67,24.04 31.47,34.47 24.46,7.98 3.92,34.89 1.09,15.32 9.32,9.35 9.22,11.53
  pour Top: 0,40.64 0,2.54 arc99 2.54,0 33.02,0 arc97 35.56,2.54 35.56,40.64 arc90 33.02,43.18 2.54,43.18 arc90
  pour Bottom: 0,40.64 0,2.54 arc99 2.54,0 33.02,0 arc97 35.56,2.54 35.56,40.64 arc90 33.02,43.18 2.54,43.18 arc90
IRG  (via drill 0.3)  (1 unrouted)
  Top 0.305: R10.2 v22.83,19.3 22.19,19.3 C18.1
  Bottom 0.254: SJ2.1 16.51,20.82
  Bottom 0.29: SJ3.1 26.67,20.82
  Bottom 0.305: v22.83,19.3 22.83,19.99 | 22.83,19.99 19.38,19.99 19.05,20.32 17.02,20.32 16.51,20.82 | SJ1.1 SJ2.1 | 26.67,20.82 26.11,20.27 23.11,20.27 22.83,19.99
MISO  (via drill 0.3)
  Top 0.203: v20.04,32.82 20.83,32.03 20.83,31.45 20.32,30.94 20.32,28.26 U3.11
  Bottom 0.203: JP6.10 27.94,39.29 26.31,37.67 20.88,37.67 20.47,37.26 20.47,36.73 20.07,36.32 20.07,32.84 v20.04,32.82
  Bottom 0.406: JP3.10 JP6.10
MOSI  (via drill 0.3)
  Top 0.203: v20.07,31.75 19.94,31.62 19.94,28.58 U3.10
  Bottom 0.203: JP6.11 28.4,37.29 22.5,37.29 22.48,37.26 21.11,37.26 20.88,37.03 20.88,36.37 20.45,35.94 20.47,33.48 20.85,33.1 20.85,32.51 v20.07,31.75
  Bottom 0.406: JP3.11 JP6.11
N$1
  Top 0.254: U3.16 22.83,28.54 22.83,28.3 23.5,27.63 24.49,27.63 24.97,28.12 25.43,28.12 26.04,28.73 26.21,28.73 26.34,28.6 26.31,28.6 26.42,28.52 26.64,28.52 26.72,28.55 26.72,29.03 26.77,29.08 27.1,29.08 27.2,28.98 27.2,28.75 27.28,28.68 28.18,28.68 Y3.3
N$2
  Top 0.254: U3.17 23.27,28.8 23.27,28.5 23.62,28.14 24.31,28.14 24.74,28.58 25.22,28.58 25.78,29.16 26.21,29.16 26.54,29.49 26.54,30.2 27.48,31.12 28.32,31.12 28.7,31.5 28.7,31.47 Y3.1
N$4
  Top 0.203: C5.2 16.15,26.89 16.99,27.72 16.99,28.42 U3.6
N$5
  Top 0.203: R4.2 D1.C
N$6
  Top 0.203: 6.34,32.4 6.58,32.64 6.58,34.51 6.37,34.71 R7.2
  Top 0.406: X1.D-1 6.34,32.4
N$7
  Top 0.203: R6.2 D3.C
N$8
  Top 0.203: 6.55,31.75 6.96,32.16 6.96,33.66 7.8,34.5 R5.2
  Top 0.406: X1.D+1 6.55,31.75
N$9
  Top 0.203: D2.2 8.14,30.6 8.39,30.35 F1.2
N$10  (via drill 0.3)  (1 unrouted)
  Top 0.305: U$4.6 17.78,6.62 17.65,6.5 15.93,6.5 15.65,6.78 15.6,7.06 v15.65,7.37
  Top 0.61: D4.C 7.62,13.46 v7.29,13.77
  Top 0.813: D5.C 8.85,10.36 7.42,11.76 7.42,13.28 D4.C
  Bottom 0.305: R1.2 11.27,7.36 v15.65,7.37
  Bottom 0.406: v7.29,13.77 7.29,11.33 8.18,10.44 8.18,8.76 9.6,7.32 10.22,7.26 R1.2
N$11
  Top 0.305: U$4.7 18.28,7.38 18.54,7.11 18.96,7.11 C8.1
N$12  (via drill 0.3)
  Top 0.305: U$4.16 19.82,14.73 19.76,14.66 19.76,12.24 19.3,12.24 19.28,12.16 U$4.9 19.28,10.44 v19.56,10.16
  Top 0.406: C11.+ 26.67,5.28 26.67,7.72 C23.+ 27.1,7.72 27.1,7.62
  Top 1.016: C24.+ 27.1,7.62 27.1,7.9 26.8,8.64 25.91,8.64 v25.65,8.89
  Bottom 0.406: v25.65,8.89 25.15,8.89 23.88,10.16 v19.56,10.16
N$13
  Top 0.305: U$4.10 19.94,11.48 20.4,11.02 20.4,9.12 20.83,8.69 20.79,8.69 C4.1
N$15
  Top 0.305: U$4.4 16.78,10.25 16.71,10.14 15.7,10.14 15.65,10.11 C7.2
N$38
  Top 0.203: R11.1 7.89,27.18 LED1.A
N$140
  Top 0.305: U$4.5 17.28,9.66 16.76,9.14 C9.1
N$160
  Top 0.305: U$4.8 18.78,8.91 18.96,8.72 | 18.96,8.72 19.05,8.64 | C8.2 18.96,8.72
N$174
  Top 0.305: U$4.38 10.14,13.23 9.4,13.97 TP1.TP
N$203
  Top 1.016: D4.A 3.16,7 6.35,3.81 U$2.P+
N$212  (via drill 0.3)  (1 unrouted)
  Top 0.305: R12.2 27.41,19.38 v27.66,19.43 | v31.19,19.43 31.33,19.43 31.36,19.41
  Bottom 0.305: v27.66,19.43 v31.19,19.43
N$222
  Top 0.305: U$4.17 21.12,15.23 22.28,14.07 25.93,14.05 26.77,13.21 29.05,13.13 L1.2
N$237  (via drill 0.3)
  Top 0.305: R14.2 14.17,6.5 14.81,5.87 23.09,5.87 SW2.2 23.47,9.63 v25.27,11.43 | v25.25,19.36 25.31,19.36 R10.1
  Bottom 0.305: v25.27,11.43 25.27,12.32 25.93,12.98 25.93,18.77 v25.25,19.36
N$242
  Top 0.305: U$4.20 20.75,16.74 21.11,17.09 22.22,17.09 22.71,16.61 24.66,16.61 | 24.66,16.61 28.07,16.61 29.97,17.78 29.97,17.33 L1.1 | R3.1 25.23,16.62 24.66,16.61
N$999  (via drill 0.3)
  Top 0.305: U$4.3 16.28,10.71 16.23,10.67 14.88,10.67 v14.5,10.69
  Bottom 0.305: v14.5,10.69 13,10.7 R1.1
RAW  (via drill 0.3)  (1 unrouted)
  Top 0.203: 11.43,32.37 13.08,32.37 13.35,32.64 13.35,33.26 U2.1 | D2.1 7.72,32.23 | 7.72,32.23 6.71,31.22 v6.71,30.8 | C19.A 11.49,35.18 U2.3 11.43,33.24 11.43,32.37 | 11.43,32.37 10.68,32.37 10.54,32.22 7.73,32.22 7.72,32.23
  Top 0.305: v11.38,33.43 11.43,33.35 U2.3
  Top 0.406: JP3.1 2.77,41.91 1.07,40.21 1.07,16.71 2.36,15.42 4.39,15.42 5.08,14.73 5.08,11.43
  Bottom 0.203: JP6.1 4.57,39.37 2.54,37.34 2.54,32 3.75,30.8 v6.71,30.8
  Bottom 0.305: SJ4.1 11.48,33.25 v11.38,33.43 | JP9.9 21.59,2.54 21.59,4.57 20.88,5.28 9.37,5.28 7.98,6.68 5.05,6.68 4.42,7.32 4.42,10.87 v5.05,11.51
  Bottom 0.406: JP3.1 JP6.1
RESET  (via drill 0.3)  (1 unrouted)
  Top 0.203: 21.63,27.65 21.71,27.58 21.72,27.58 21.87,27.42 21.87,27.2 21.36,26.7 20.8,26.7 20.57,26.92 20.07,26.92 18.54,25.4 10.26,25.4 9.45,26.26 9.03,26.26 7.58,26.26 5.41,26.26 v5.05,26.67 5.05,26.75 5.39,27.08 5.88,27.09 R2.1
  Top 0.254: v5.05,26.67 3.94,26.67 3.1,25.83 | C2.2 3.1,25.83 | 3.1,25.83 2.64,25.55 | v22.05,32.59 21.23,31.77 21.23,31.17 20.75,30.68 20.75,28.55 21.34,27.97 | 30.48,34.29 30.48,34.19 S2.3
  Top 0.305: 30.48,33.02 28.45,33.02 v27.81,32.38
  Top 0.406: S2.4 30.48,29.08 30.48,33.02 30.48,34.29
  Bottom 0.203: JP6.3 8.89,38.1 7.11,38.1 6.73,38.48 5.97,38.48 5.59,38.1 4.06,38.1 2.97,37.01 2.97,34.16 4.34,32.79 6.86,32.79 7.85,31.8 7.85,29.06 5.46,26.72 5.41,26.67 v5.05,26.67
  Bottom 0.305: v27.81,32.38 27.56,32.38 26.47,33.48 26.01,33.48 24.94,32.41 21.97,32.41 v22.05,32.59
  Bottom 0.406: JP3.3 JP6.3
RXD  (via drill 0.3)  (1 unrouted)
  Top 0.305: U$4.27 16.78,19.8 16.36,20.22 v8.94,20.22
  Top 0.406: 3.4,17.49 v3.3,17.55
  Bottom 0.305: v8.94,20.22 6.3,20.22 3.63,17.58 v3.3,17.55
  Bottom 0.406: v3.3,17.55 2.54,16.56 2.54,6.35 3.81,5.08 7.62,5.08 10.16,2.54 13.97,2.54 JP9.3
RXI  (via drill 0.3)
  Top 0.203: 24.07,30.09 24.16,30 25.43,30 v25.81,29.94
  Top 0.406: R13.2 5.28,19.38 5.28,19.34 R8.1 7.62,19.91 JP4.11 JP7.11
  Bottom 0.203: JP7.11 7.62,26.09 9.66,28.13 13.06,28.13 13.97,27.22 13.97,26.58 13.98,26.58 14.38,26.18 16.42,26.18 16.62,26.38 | v25.81,29.94 24.79,30.89 22.69,30.89 19.92,28.12 17.47,28.12 16.62,27.26 16.62,26.38 | 16.62,26.38 16.62,26.37
SAVEB
  Top 0.305: U$4.36 13.9,14.23 13.41,13.77 10.62,13.77 10.41,13.97 10.41,15.75 9.4,15.75 TP9.TP 9.4,15.77 9.22,15.77 5.16,15.8 4.7,16.08 2.62,16.08 1.9,16.79 1.88,20.93 JP5.1
SCK  (via drill 0.3)
  Top 0.203: v19.05,33.02 19.3,32.77 19.3,28.64 | 19.3,28.61 19.3,28.64 | U3.9 19.3,28.64
  Bottom 0.203: JP6.9 24.13,38.1 20.57,38.1 20.07,37.59 20.07,36.96 19.56,36.45 19.56,33.78 19.05,33.27 v19.05,33.02
  Bottom 0.406: JP3.9 JP6.9
TXAL1
  Top 0.305: U$4.35 11.86,14.73 Y2.3
TXAL2
  Top 0.305: U$4.34 13.73,15.23 13.21,15.75 13.21,16.51 12.95,16.76 11.87,16.76 Y2.1
TXD  (via drill 0.3)
  Top 0.305: U$4.28 16.28,19.28 15.9,19.66 9.7,19.66 8.76,18.69 8.2,18.09 7.9,17.78 7.63,17.7 R8.2
  Top 0.406: JP9.7 19.05,2.54 11.74,2.54 v10.77,3.51 | v7.14,17.5 R8.2
  Bottom 0.406: v10.77,3.51 10.21,3.51 7.82,5.89 4.39,5.89 3.43,6.86 3.43,13.18 6.68,16.43 6.99,16.76 v7.14,17.5
TXLED  (1 unrouted)
  Top 0.203: 24.92,30.79 24.76,30.79 24.76,30.8 24.86,30.8 25.66,31.6 26.39,31.6 27.01,32.22 27,33.34 27.41,33.75 28.2,33.76 28.57,34.13 28.57,34.99 28.85,35.28 32.58,35.28 R6.1
TXO  (via drill 0.3)
  Top 0.203: 24.42,30.44 24.46,30.4 24.46,30.38 25.12,30.38 25.65,30.91 v26.08,30.91
  Top 0.406: JP4.12 3.81,20.32 3.81,19.75 R9.1
  Bottom 0.203: JP7.12 9.53,28.58 9.57,28.53 13.24,28.53 14.37,27.39 14.37,26.78 14.57,26.58 16.16,26.58 16.23,26.65 16.23,27.45 17.35,28.58 19.72,28.58 22.63,31.48 25.51,31.48 v26.08,30.91
  Bottom 0.406: JP4.12 JP7.12
UC1  (via drill 0.3)
  Top 0.305: U$4.26 17.28,18.29 UC1.TP
  Bottom 0.305: UC1.TP 18.03,19.05 UC1..TP
  other vias: 17.78,18.8
UC2  (via drill 0.3)
  Top 0.305: U$4.29 15.78,18.26 UC2.TP
  Bottom 0.305: UC2.TP 15.49,19.05 UC2..TP
  other vias: 15.24,18.8
UVCC  (via drill 0.3)  (1 unrouted)
  Top 0.203: 9.4,33.28 F1.1 9.26,33.42 C6.2 9.97,34.71 v10.46,34.27 | v15.06,31.87 15.06,30.85 15.53,30.38 16.18,30.38 16.18,30.4 16.23,30.45 | v15.14,27.7 15.3,27.56 15.3,26.22 15.52,26 16.76,26 16.97,26.21 16.97,27.12 17.38,27.54 17.38,28.15 17.42,28.15 U3.7
  Bottom 0.203: 10.39,34.29 v10.46,34.27 11.53,34.27 12.4,33.4 13.64,33.4 15.06,31.98 v15.06,31.87 13.51,30.33 13.51,28.8 14.61,27.7 v15.14,27.7
  Bottom 0.305: v10.46,34.27 8.89,34.27 8.89,34.29
VBUS1  (via drill 0.3)
  Top 0.305: v5,34.87 4.88,35.05 5.39,34.54 5.39,34.11 5.79,33.71 6.04,33.71 6.1,33.66 6.1,33.1 6.04,33.05
  Bottom 0.305: SJ5.1 6.65,34.31 5.92,35.05 4.98,35.05 v5,34.87
VCC  (via drill 0.3, 0.3 pad 0.6)  (1 unrouted)
  Top 0.203: C3.2 25.31,36.51 25.65,36.85 27.93,36.85 D3.A | 27.27,27.14 C10.1 | 28.66,27.38 D1.A 28.62,27.27 C10.1 | 21.98,28 22.39,27.59 22.39,27.34 23.22,26.51 v24.39,26.51 24.53,26.42 26.36,26.42 C10.1 | 25.31,35.83 C3.2 | 24.42,33.06 24.75,33.39 26.21,33.39 arc90 26.27,33.44 | U3.34 19.23,36.33 19.23,37.33 v19.21,37.35 | C13.A 11.04,28.31 | 13.5,31.95 11.19,31.95 10.82,31.59 10.82,29.61 11.04,29.4 C13.A | 13.5,31.95 arc90 13.39,31.84 U2.5 | 13.96,33.14 13.96,34.21 14.17,34.41 14.65,34.41 14.93,34.69 14.93,36.82 v14.23,37.51 12.7,39.05 JP6.4 12.7,39.23 | 13.96,33.14 13.96,32.18 13.73,31.95 13.5,31.95 | 13.96,33.14 14,33.02 15.53,33.02 15.87,32.72 | R2.2 6.36,28.78 R11.2 8.64,27.93 10.59,27.94 10.65,27.88 C13.A | v26.27,32.55 26.27,33.44 | 26.27,33.44 26.27,35.11 C3.2
  Top 0.254: v17.75,31.09 17.57,31.01 U3.44
  Top 0.305: U$4.40 13.43,12.23 v13.21,12.37 | v13.21,12.37 C20.1 12.19,12.45 | 21.46,18.06 v21.59,18.03 22.25,18.03 22.68,17.6 R3.2 | 12.45,18.54 C21.1 11.91,18.57 12.7,17.78 | U$4.19 21.56,16.23 v21.59,16.26 22.16,16.26 C15.1 22.93,15.71 v22.96,15.67 | U$4.11 21.75,12.23 v21.89,12.37 | U$4.30 15.23,17.53 12.95,17.53 12.7,17.78 | R14.1 13.96,9.18 13.21,9.93 v13.21,12.37 | 12.7,17.78 13,17.78 v13.26,17.53 | v12.42,31.24 13.33,30.81 13.36,30.79 13.36,30.72 U2.5
  Top 0.406: v10.52,26.77 10.49,27 11.43,27.94 11.1,27.94 C13.A | C21.1 11.94,18.57
  Bottom 0.203: v24.39,26.51 24.53,26.42 25.66,26.42 26.22,26.98 27.67,26.98 28.1,27.4 28.1,30.43 26.27,32.27 | 26.26,32.56 arc-90 v26.27,32.55 | v14.23,37.51 14.56,37.51
  Bottom 0.254: v19.21,37.35 17.74,37.35 16.94,36.55 15.19,36.55 v14.23,37.51 | v17.75,31.09 19.63,29.21 19.68,29.21 22.4,31.93 25.48,31.93 26.1,32.55 v26.27,32.55 26.27,32.27
  Bottom 0.305: v21.59,16.26 v21.59,18.03 20.6,18.03 20.09,17.53 17.78,17.53 | v13.21,12.37 13.21,17.17 v13.26,17.53 17.78,17.53 | v22.96,15.67 22.96,13.44 v21.89,12.37 | 11.43,19.05 11.43,25.42 | TP13.TP 17.78,17.53 | SJ4.2 11.82,31.54 v12.42,31.24
  Bottom 0.406: JP3.4 JP6.4 | 13.46,17.53 v13.26,17.53 12.95,17.53 11.43,19.05 | 11.43,25.42 10.52,26.34 v10.52,26.77
(copper drawn outside any net)
  shapes: Bottom area x2

### Text on the board
tPlace: RAW | GND | RST | VCC | A3 | A2 | A1 | A0 | 15 | 14 | 16 | 10 | TXO | RXI | GND | 3 | 4 | 5 | 6 | 7 | 8 | 9 | GND | 2
bPlace: 5V | 3.3V | KONNEKTING | Micro | Pro | HW1.2
tDocu: N. Seidle, revised by P. Lewis